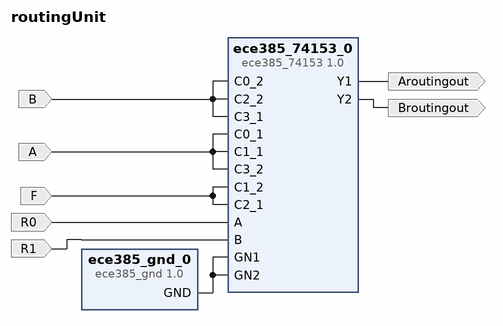
[diagram p0: block diagram of the top level]
# Vivado block design routingUnit, xc7s50csga324-1, Vivado 2022.2
create_bd_design routingUnit

create_bd_port -dir I R1
create_bd_port -dir I R0
create_bd_port -dir I B
create_bd_port -dir I A
create_bd_port -dir I F
create_bd_port -dir O Aroutingout
create_bd_port -dir O Broutingout

create_bd_cell -type ip -vlnv ece.illinois.edu:ece385:ece385_74153:1.0 ece385_74153_0
create_bd_cell -type ip -vlnv ece.illinois.edu:ece385:ece385_gnd:1.0 ece385_gnd_0

# ---- connections ----

connect_bd_net -net A_1 [get_bd_ports B] [get_bd_pins ece385_74153_0/C3_1] [get_bd_pins ece385_74153_0/C0_2] [get_bd_pins ece385_74153_0/C2_2]
connect_bd_net [get_bd_ports A] [get_bd_pins ece385_74153_0/C1_1] [get_bd_pins ece385_74153_0/C0_1] [get_bd_pins ece385_74153_0/C3_2]
connect_bd_net [get_bd_ports F] [get_bd_pins ece385_74153_0/C2_1] [get_bd_pins ece385_74153_0/C1_2]
connect_bd_net -net R0_1 [get_bd_ports R0] [get_bd_pins ece385_74153_0/A]
connect_bd_net -net R1_1 [get_bd_ports R1] [get_bd_pins ece385_74153_0/B]
connect_bd_net [get_bd_pins ece385_74153_0/Y1] [get_bd_ports Aroutingout]
connect_bd_net [get_bd_pins ece385_74153_0/Y2] [get_bd_ports Broutingout]
connect_bd_net [get_bd_pins ece385_gnd_0/GND] [get_bd_pins ece385_74153_0/GN1] [get_bd_pins ece385_74153_0/GN2]

validate_bd_design
save_bd_design
